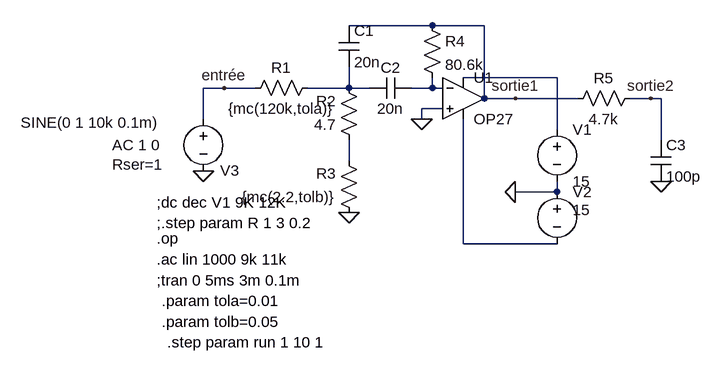
[diagram p0: schematic premier_circuit_q1a7.asc]
premier_circuit_q1a7.asc, the LTspice schematic file:
Version 4
SHEET 1 880 680
WIRE 192 16 64 16
WIRE 272 16 192 16
WIRE 384 96 240 96
WIRE -128 112 -160 112
WIRE -80 112 -128 112
WIRE 64 112 64 80
WIRE 64 112 0 112
WIRE 96 112 64 112
WIRE 192 112 192 96
WIRE 192 112 160 112
WIRE 208 112 192 112
WIRE 272 128 272 16
WIRE 320 128 272 128
WIRE 416 128 320 128
WIRE 528 128 496 128
WIRE 544 128 528 128
WIRE 208 144 176 144
WIRE -160 160 -160 112
WIRE 176 160 176 144
WIRE 384 176 384 96
WIRE 544 192 544 128
WIRE 64 224 64 192
WIRE 384 272 384 256
WIRE 384 272 320 272
WIRE 240 352 240 160
WIRE 384 352 240 352
FLAG 544 256 0
FLAG -160 240 0
FLAG 64 304 0
FLAG 176 160 0
FLAG 320 272 0
FLAG 320 128 sortie1
FLAG 528 128 sortie2
FLAG -128 112 entrée
SYMBOL voltage 384 160 R0
WINDOW 123 0 0 Left 0
WINDOW 39 0 0 Left 0
SYMATTR InstName V1
SYMATTR Value 15
SYMBOL voltage 384 256 R0
WINDOW 3 24 44 Left 2
WINDOW 123 24 124 Left 2
WINDOW 39 0 0 Left 0
SYMATTR InstName V2
SYMATTR Value 15
SYMBOL voltage -160 144 R0
WINDOW 0 26 95 Left 2
WINDOW 3 -281 21 Left 2
WINDOW 123 -140 56 Left 2
WINDOW 39 -140 86 Left 2
SYMATTR InstName V3
SYMATTR Value SINE(0 1 10k 0.1m)
SYMATTR Value2 AC 1 0
SYMATTR SpiceLine Rser=1
SYMBOL res 16 96 R90
WINDOW 0 0 56 VBottom 2
WINDOW 3 32 56 VTop 2
SYMATTR InstName R1
SYMATTR Value {mc(120k,tola)}
SYMBOL res 80 208 R180
WINDOW 0 36 76 Left 2
WINDOW 3 36 40 Left 2
SYMATTR InstName R2
SYMATTR Value 4.7
SYMBOL res 80 320 R180
WINDOW 0 36 76 Left 2
WINDOW 3 36 40 Left 2
SYMATTR InstName R3
SYMATTR Value {mc(2.2,tolb)}
SYMBOL cap 48 16 R0
SYMATTR InstName C1
SYMATTR Value 20n
SYMBOL cap 160 96 R90
WINDOW 0 0 32 VBottom 2
WINDOW 3 32 32 VTop 2
SYMATTR InstName C2
SYMATTR Value 20n
SYMBOL res 176 0 R0
SYMATTR InstName R4
SYMATTR Value 80.6k
SYMBOL res 512 112 R90
WINDOW 0 0 56 VBottom 2
WINDOW 3 32 56 VTop 2
SYMATTR InstName R5
SYMATTR Value 4.7k
SYMBOL cap 528 192 R0
SYMATTR InstName C3
SYMATTR Value 100p
SYMBOL OpAmps\\OP27 240 64 R0
SYMATTR InstName U1
TEXT -232 288 Left 2 !;dc dec V1 9K 12K
TEXT -232 320 Left 2 !;.step param R 1 3 0.2
TEXT -232 344 Left 2 !.op
TEXT -232 376 Left 2 !.ac lin 1000 9k 11k
TEXT -232 408 Left 2 !;tran 0 5ms 3m 0.1m
TEXT -224 440 Left 2 !.param tola=0.01
TEXT -224 472 Left 2 !.param tolb=0.05
TEXT -216 504 Left 2 !.step param run 1 10 1

The netlist it stands for:
* premier_circuit_q1a7.asc
V1 N001 0 15
V2 0 N005 15
V3 entrée 0 SINE(0 1 10k 0.1m) AC 1 0 Rser=1
R1 N002 entrée {mc(120k,tola)}
R2 N004 N002 4.7
R3 0 N004 {mc(2.2,tolb)}
C1 sortie1 N002 20n
C2 N003 N002 20n
R4 sortie1 N003 80.6k
R5 sortie2 sortie1 4.7k
C3 sortie2 0 100p
XU1 0 N003 N001 N005 sortie1 OP27  ; pins In+ In- V+ V- OUT
;dc dec V1 9K 12K
;.step param R 1 3 0.2
.op
.ac lin 1000 9k 11k
;tran 0 5ms 3m 0.1m
.param tola=0.01
.param tolb=0.05
.step param run 1 10 1
.lib ADI.lib
.backanno
.end